# Altium schematic sheet Client_Esp32.SchDoc
size A4; SheetNumber: 1; SheetTotal: 1
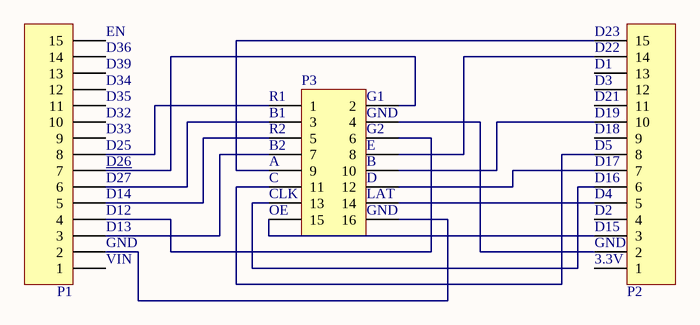
[diagram p0: Client_Esp32.SchDoc]

## Parts
P1  Header 15  [HDR1X15]  (value not drawn)
P2  Header 15  [HDR1X15]  (value not drawn)
P3  Header 8X2  [HDR2X8]  (value not drawn)

## Nets
NetP1_2: P1.2 P3.16
NetP1_3: P1.3 P3.7
NetP1_4: P1.4 P3.6
NetP1_5: P1.5 P3.5
NetP1_6: P1.6 P3.3
NetP1_7: P1.7 P3.2
NetP1_8: P1.8 P3.1
NetP2_2: P2.2 P3.4
NetP2_3: P2.3 P3.15
NetP2_5: P2.5 P3.14
NetP2_6: P2.6 P3.13
NetP2_7: P2.7 P3.12
NetP2_8: P2.8 P3.11
NetP2_10: P2.10 P3.10
NetP2_14: P2.14 P3.8
NetP2_15: P2.15 P3.9

Not connected (* = marked no-connect by the designer): P1 1 9 10 11 12 13 14 15; P2 1 4 9 11 12 13

## Notes on the sheet
- (near P1) D36
- (near P1) EN
- (near P2) D23
- (near P2) D22
- (near P1) D33
- (near P1) D32
- (near P1) D35
- (near P1) D34
- (near P1) D39
- (near P3) R1
- (near P3) B1
- (near P3) R2
- (near P3) G1
- (near P3) GND
- (near P3) G2
- (near P2) D1
- (near P2) D3
- (near P2) D21
- (near P2) D19
- (near P2) D18
- (near P1) D12
- (near P1) D14
- (near P1) D27
- (near P1) D26
- (near P1) D25
- (near P3) B2
- (near P3) A
- (near P3) C
- (near P3) CLK
- (near P3) OE
- (near P3) E
- (near P3) B
- (near P3) D
- (near P3) LAT
- (near P2) D5
- (near P2) D17
- (near P2) D16
- (near P2) D4
- (near P2) D2
- (near P1) VIN
- (near P1) GND
- (near P1) D13
- (near P2) D15
- (near P2) GND
- (near P2) 3.3V

## Library data of the parts
P1 P2 = Header 15: Header, 15-Pin; LatestRevisionDate: 17-Jul-2002; LatestRevisionNote: Re-released for DXP Platform.; Publisher: Altium Limited
P3 = Header 8X2: Header, 8-Pin, Dual row; LatestRevisionDate: 17-Jul-2002; LatestRevisionNote: Re-released for DXP Platform.; Publisher: Altium Limited